# Altium project FMC_SDR_XFE.PrjPcb (part 1 of 3)
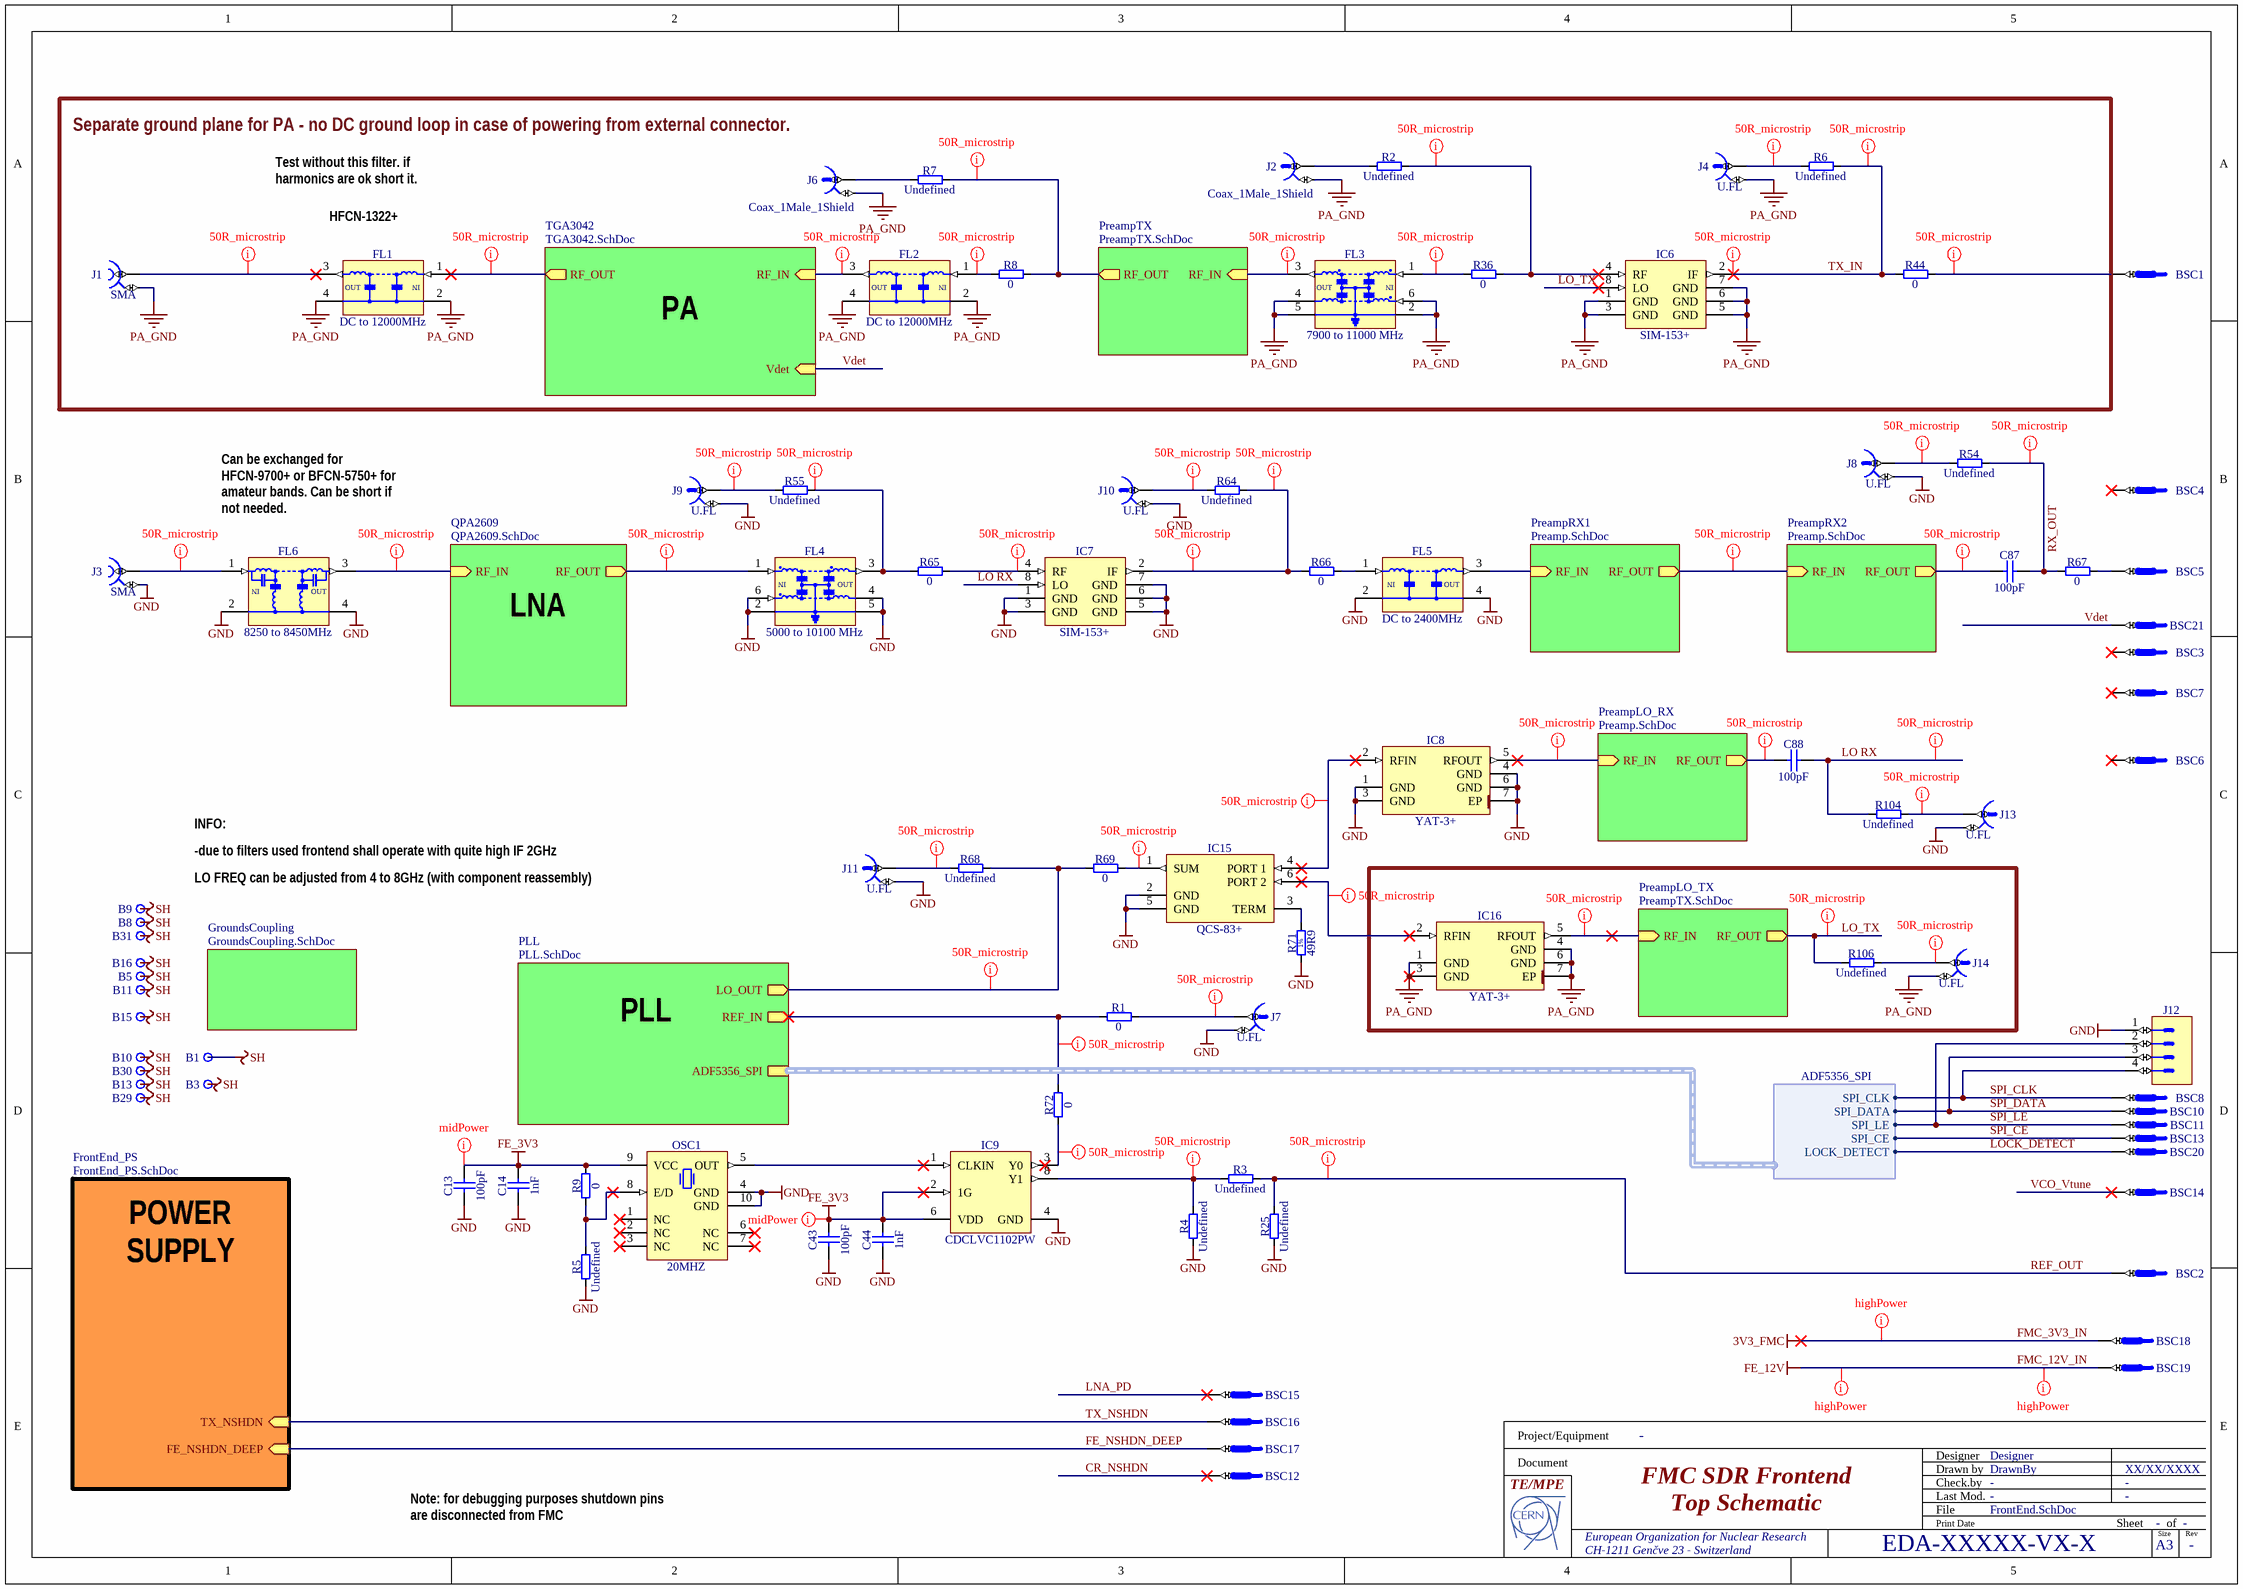
[diagram p0: FrontEnd.SchDoc]
14 sheets, 430 parts. Net scope: hierarchical (ports join the sheet entries above them; power ports are global).
Board file: FMC_SDR_XFE.PcbDoc
Sheets:
  FrontEnd.SchDoc
    FrontEnd_PS = FrontEnd_PS.SchDoc
      BUCKBOOST_PA = LTM8056.SchDoc
      INV_neg5V_PA = LTM8074neg_PA.SchDoc
      INV_neg5V = LTM8074neg.SchDoc
      BUCK_5V5_PA = LTM8074_PA.SchDoc
      BUCK_5V5 = LTM8074.SchDoc
      BUCK_3V8 = LTM8074.SchDoc
      PA_LDO = LT3080.SchDoc
    QPA2609 = QPA2609.SchDoc
    TGA3042 = TGA3042.SchDoc
    PLL = PLL.SchDoc
    PreampLO_RX = Preamp.SchDoc
    PreampLO_TX = PreampTX.SchDoc
    PreampTX = PreampTX.SchDoc
    PreampRX1 = Preamp.SchDoc
    PreampRX2 = Preamp.SchDoc
    GroundsCoupling = GroundsCoupling.SchDoc

## Sheet FrontEnd.SchDoc: FMC SDR Frontend
size 420 x 297 mm; CheckedBy: -; CompanyName: CERN; DrawnBy: DrawnBy; Organization: CERN; Address1: European Organization for Nuclear Research; Address2: CH-1211 Genčve 23 - Switzerland; Revision: -; SheetNumber: -; SheetTotal: -; EDA_Number: EDA-XXXXX-VX-X; Projet: -; ModifiedBy: -; CreateDate: XX/XX/XXXX; CheckedDate: -; Title2: Top Schematic; DivGrp: TE/MPE; Designer: Designer; ModifiedDate: -

### Parts
B1  Plated Hole  [MTG240_400]  (value not drawn)  (no BOM)
B3  Plated Hole  [MTG240_400]  (value not drawn)  (no BOM)
B5  Plated Hole  [MTG240_400]  (value not drawn)  (no BOM)
B8  Plated Hole  [MTG240_400]  (value not drawn)  (no BOM)
B9  Plated Hole  [MTG240_400]  (value not drawn)  (no BOM)
B10  Plated Hole  [MTG240_400]  (value not drawn)  (no BOM)
B11  Plated Hole  [MTG240_400]  (value not drawn)  (no BOM)
B13  Plated Hole  [MTG240_400]  (value not drawn)  (no BOM)
B15  Plated Hole  [MTG240_400]  (value not drawn)  (no BOM)
B16  Plated Hole  [MTG240_400]  (value not drawn)  (no BOM)
B29  Plated Hole  [MTG240_400]  (value not drawn)  (no BOM)
B30  Plated Hole  [MTG240_400]  (value not drawn)  (no BOM)
B31  Plated Hole  [MTG240_400]  (value not drawn)  (no BOM)
BSC1  06031206 Male  [PCB_CONN_0603M]  (value not drawn)
BSC2  06031206 Male  [PCB_CONN_0603M]  (value not drawn)
BSC3  06031206 Male  [PCB_CONN_0603M]  (value not drawn)
BSC4  06031206 Male  [PCB_CONN_0603M]  (value not drawn)
BSC5  06031206 Male  [PCB_CONN_0603M]  (value not drawn)
BSC6  06031206 Male  [PCB_CONN_0603M]  (value not drawn)
BSC7  06031206 Male  [PCB_CONN_0603M]  (value not drawn)
BSC8  06031206 Male  [PCB_CONN_0603M]  (value not drawn)
BSC10  06031206 Male  [PCB_CONN_0603M]  (value not drawn)
BSC11  06031206 Male  [PCB_CONN_0603M]  (value not drawn)
BSC12  06031206 Male  [PCB_CONN_0603M]  (value not drawn)
BSC13  06031206 Male  [PCB_CONN_0603M]  (value not drawn)
BSC14  06031206 Male  [PCB_CONN_0603M]  (value not drawn)
BSC15  06031206 Male  [PCB_CONN_0603M]  (value not drawn)
BSC16  06031206 Male  [PCB_CONN_0603M]  (value not drawn)
BSC17  06031206 Male  [PCB_CONN_0603M]  (value not drawn)
BSC18  1206 Male  [PCB_CONN_1206M]  (value not drawn)
BSC19  1206 Male  [PCB_CONN_1206M]  (value not drawn)
BSC20  06031206 Male  [PCB_CONN_0603M]  (value not drawn)
BSC21  06031206 Male  [PCB_CONN_0603M]  (value not drawn)
C13  100pF  [CAPC1005X55N]
C14  1nF  [CAPC1005X55N]
C43  100pF  [CAPC1005X55N]
C44  1nF  [CAPC1005X55N]
C87  100pF  [CAPC1005X55N]
C88  100pF  [CAPC1005X55N]
FL1  DC to 12000MHz  [FIL_MINI-CIRCUITS_FV1206-4]
FL2  DC to 12000MHz  [FIL_MINI-CIRCUITS_FV1206-4]
FL3  7900 to 11000 MHz  [FIL_MINI-CIRCUITS_FV1206-1]
FL4  5000 to 10100 MHz  [FIL_MINI-CIRCUITS_FV1206-1]
FL5  DC to 2400MHz  [FIL_MINI-CIRCUITS_FV1206]
FL6  8250 to 8450MHz  [FIL_MINI-CIRCUITS_FV1206-4]
IC6  SIM-153+  [MINI-CIRCUITS_HV1195]
IC7  SIM-153+  [MINI-CIRCUITS_HV1195]
IC8  YAT-3+  [MINI-CIRCUITS_MC1630]
IC9  CDCLVC1102PW  [SOP65P640X120-8N]
IC15  QCS-83+  [MINI-CIRCUITS_GE0805C-1]
IC16  YAT-3+  [MINI-CIRCUITS_MC1630]
J1  SMA  [TELEGARTNER_J01151A0451]
J2  Coax_1Male_1Shield  [ROSENBERGER_19S103-400L5]
J3  SMA  [TELEGARTNER_J01151A0451]
J4  U.FL  [HIROSE_U.FL-R-SMT-1(10)]
J6  Coax_1Male_1Shield  [ROSENBERGER_19S103-400L5]
J7  U.FL  [HIROSE_U.FL-R-SMT-1(10)]
J8  U.FL  [HIROSE_U.FL-R-SMT-1(10)]
J9  U.FL  [HIROSE_U.FL-R-SMT-1(10)]
J10  U.FL  [HIROSE_U.FL-R-SMT-1(10)]
J11  U.FL  [HIROSE_U.FL-R-SMT-1(10)]
J12  Header 4  [SAMTEC_HW-04-15-L-S-400-150]  (value not drawn)
J13  U.FL  [HIROSE_U.FL-R-SMT-1(10)]
J14  U.FL  [HIROSE_U.FL-R-SMT-1(10)]
OSC1  20MHZ  [OSC_KYOCERA_KT7050A]
R1  0  [RESC1005X40N]
R2  Undefined  [RESC1005X40N]
R3  Undefined  [RESC1005X40N]
R4  Undefined  [RESC1005X40N]
R5  Undefined  [RESC1005X40N]
R6  Undefined  [RESC1005X40N]
R7  Undefined  [RESC1005X40N]
R8  0  [RESC1005X40N]
R9  0  [RESC1005X40N]
R25  Undefined  [RESC1005X40N]
R36  0  [RESC1005X40N]
R44  0  [RESC1005X40N]
R54  Undefined  [RESC1005X40N]
R55  Undefined  [RESC1005X40N]
R64  Undefined  [RESC1005X40N]
R65  0  [RESC1005X40N]
R66  0  [RESC1005X40N]
R67  0  [RESC1005X40N]
R68  Undefined  [RESC1005X40N]
R69  0  [RESC1005X40N]
R71  49R9  [RESC1005X40N]
R72  0  [RESC1005X40N]
R104  Undefined  [RESC1005X40N]
R106  Undefined  [RESC1005X40N]

### Sub-sheets
FrontEnd_PS = FrontEnd_PS.SchDoc: TX_NSHDN (in), FE_NSHDN_DEEP (in)
GroundsCoupling = GroundsCoupling.SchDoc: no entries
PLL = PLL.SchDoc: REF_IN (out), ADF5356_SPI (harness ADF5356_SPI), LO_OUT (out)
PreampLO_RX = Preamp.SchDoc: RF_OUT (out), RF_IN (in)
PreampLO_TX = PreampTX.SchDoc: RF_OUT (out), RF_IN (in)
PreampRX1 = Preamp.SchDoc: RF_OUT (out), RF_IN (in)
PreampRX2 = Preamp.SchDoc: RF_OUT (out), RF_IN (in)
PreampTX = PreampTX.SchDoc: RF_OUT (out), RF_IN (in)
QPA2609 = QPA2609.SchDoc: RF_OUT (out), RF_IN (in)
TGA3042 = TGA3042.SchDoc: RF_OUT (out), RF_IN (in), Vdet (in)

### Harnesses
ADF5356_SPI: SPI_CLK, SPI_DATA, SPI_LE, LOCK_DETECT, SPI_CE

### Nets
FE_3V3: C13.2 C14.2 C43.2 C44.2 IC9.2(1G) IC9.6(VDD) OSC1.9(VCC) R9.2
FMC_3V3_IN: BSC18.1  [also labelled 3V3_FMC]
FMC_12V_IN: BSC19.1  [also labelled FE_12V]
GND: C13.1 C14.1 C43.1 C44.1 FL4.2(GND) FL4.4(GND) FL4.5(GND) FL4.6(RFIN) FL5.2(GND) FL5.4(GND) FL6.2(GND) FL6.4(GND) IC7.1(GND) IC7.3(GND) IC7.5(GND) IC7.6(GND) IC7.7(GND) IC8.1(GND) IC8.3(GND) IC8.4(GND) IC8.6(GND) IC8.7(EP) IC9.4(GND) IC15.2(GND) IC15.5(GND) J3.2 J7.2 J8.2 J9.2 J10.2 J11.2 J12.1 J13.2 OSC1.4(GND) OSC1.10(GND) R4.1 R5.1 R25.1 R71.1
PA_GND: FL1.2(GND) FL1.4(GND) FL2.2(GND) FL2.4(GND) FL3.2(GND) FL3.4(GND) FL3.5(GND) FL3.6(RFIN) IC6.1(GND) IC6.3(GND) IC6.5(GND) IC6.6(GND) IC6.7(GND) IC16.1(GND) IC16.3(GND) IC16.4(GND) IC16.6(GND) IC16.7(EP) J1.2 J2.2 J4.2 J6.2 J14.2
SH: B1.1 B3.1 B5.1 B8.1 B9.1 B10.1 B11.1 B13.1 B15.1 B16.1 B29.1 B30.1 B31.1
CR_NSHDN: BSC12.1
FE_NSHDN_DEEP: BSC17.1 ; sheet FrontEnd_PS/FE_NSHDN_DEEP  [project net FE_NSHDN]
LNA_PD: BSC15.1
LO RX: C88.2 IC7.8(LO) R104.2
LO_TX: IC6.8(LO) R106.2 ; sheet PreampLO_TX/RF_OUT
LOCK_DETECT: BSC20.1 ; sheet PLL/ADF5356_SPI.LOCK_DETECT
REF_OUT: BSC2.1 R3.2 R25.2
RX_OUT: C87.2 R54.2 R67.1
SPI_CE: BSC13.1 ; sheet PLL/ADF5356_SPI.SPI_CE  [project net 5356_SPI_CE]
SPI_CLK: BSC8.1 J12.4 ; sheet PLL/ADF5356_SPI.SPI_CLK  [project net 5356_SPI_CLK]
SPI_DATA: BSC10.1 J12.3 ; sheet PLL/ADF5356_SPI.SPI_DATA  [project net 5356_SPI_DATA]
SPI_LE: BSC11.1 J12.2 ; sheet PLL/ADF5356_SPI.SPI_LE  [project net 5356_SPI_LE]
TX_IN: IC6.2(IF) R6.2 R44.1
TX_NSHDN: BSC16.1 ; sheet FrontEnd_PS/TX_NSHDN
VCO_Vtune: BSC14.1
Vdet: BSC21.1 ; sheet TGA3042/Vdet
NetBSC1_1: BSC1.1 R44.2
NetBSC5_1: BSC5.1 R67.2
NetC10_PreampLO_RX_1: IC8.5(RFOUT) ; sheet PreampLO_RX/RF_IN
NetC10_PreampRX1_1: FL5.3(RFOUT) ; sheet PreampRX1/RF_IN
NetC10_PreampRX2_1: sheet PreampRX1/RF_OUT, sheet PreampRX2/RF_IN
NetC37_2: R68.2 R69.1 ; sheet PLL/LO_OUT
NetC47_1: R1.2 R72.2 ; sheet PLL/REF_IN
NetC81_PreampTX_2: R7.2 R8.2 ; sheet PreampTX/RF_OUT
NetC82_PreampLO_TX_1: IC16.5(RFOUT) ; sheet PreampLO_TX/RF_IN
NetC82_PreampTX_1: FL3.3(RFOUT) ; sheet PreampTX/RF_IN
NetC87_1: C87.1 ; sheet PreampRX2/RF_OUT
NetC88_1: C88.1 ; sheet PreampLO_RX/RF_OUT
NetFL1_1: FL1.1(RFIN) ; sheet TGA3042/RF_OUT
NetFL1_3: FL1.3(RFOUT) J1.1
NetFL2_1: FL2.1(RFIN) R8.1
NetFL2_3: FL2.3(RFOUT) ; sheet TGA3042/RF_IN
NetFL3_1: FL3.1(RFIN) R36.1
NetFL4_1: FL4.1(RFIN) ; sheet QPA2609/RF_OUT
NetFL4_3: FL4.3(RFOUT) R55.2 R65.1
NetFL5_1: FL5.1(RFIN) R66.2
NetFL6_1: FL6.1(RFIN) J3.1
NetFL6_3: FL6.3(RFOUT) ; sheet QPA2609/RF_IN
NetIC6_4: IC6.4(RF) R2.2 R36.2
NetIC7_2: IC7.2(IF) R64.2 R66.1
NetIC7_4: IC7.4(RF) R65.2
NetIC8_2: IC8.2(RFIN) IC15.4(PORT_1)
NetIC9_1: IC9.1(CLKIN) OSC1.5(OUT)
NetIC9_3: IC9.3(Y0) R72.1
NetIC9_8: IC9.8(Y1) R3.1 R4.2
NetIC15_1: IC15.1(SUM) R69.2
NetIC15_3: IC15.3(TERM) R71.2
NetIC15_6: IC15.6(PORT_2) IC16.2(RFIN)
NetJ2_1: J2.1 R2.1
NetJ4_1: J4.1 R6.1
NetJ6_1: J6.1 R7.1
NetJ7_1: J7.1 R1.1
NetJ8_1: J8.1 R54.1
NetJ9_1: J9.1 R55.1
NetJ10_1: J10.1 R64.1
NetJ11_1: J11.1 R68.1
NetJ13_1: J13.1 R104.1
NetJ14_1: J14.1 R106.1
NetOSC1_8: OSC1.8(E/D) R5.2 R9.1

Not connected (* = marked no-connect by the designer): BSC3 1*; BSC4 1*; BSC6 1*; BSC7 1*; OSC1 1(NC)* 2(NC)* 3(NC)* 6(NC)* 7(NC)*

### Layout directives
net class 50R_class: LO RX, LO_TX, NetBSC1_1, NetC10_PreampLO_RX_1, NetC10_PreampRX2_1, NetC37_2, NetC47_1, NetC81_PreampTX_2, NetC82_PreampLO_TX_1, NetC82_PreampTX_1, NetC87_1, NetC88_1, NetFL1_1, NetFL1_3, NetFL2_1, NetFL2_3, NetFL3_1, NetFL4_1, NetFL4_3, NetFL6_1, NetFL6_3, NetIC6_4, NetIC7_2, NetIC7_4, NetIC8_2, NetIC9_3, NetIC9_8, NetIC15_1, NetIC15_6, NetJ4_1, NetJ7_1, NetJ8_1, NetJ9_1, NetJ10_1, NetJ11_1, NetJ13_1, NetJ14_1, REF_OUT, RX_OUT, TX_IN
net class highPower: FMC_3V3_IN, FMC_12V_IN
net class midPower: FE_3V3

### Notes on the sheet
- Separate ground plane for PA - no DC ground loop in case of powering from external connector.
- Test without this filter. if harmonics are ok short it.
- (near FL1) HFCN-1322+
- PA
- Can be exchanged for HFCN-9700+ or BFCN-5750+ for amateur bands. Can be short if not needed.
- LNA
- -due to filters used frontend shall operate with quite high IF 2GHz
- INFO:
- LO FREQ can be adjusted from 4 to 8GHz (with component reassembly)
- PLL
- POWER
  SUPPLY
- Note: for debugging purposes shutdown pins are disconnected from FMC
- Project/Equipment
- Document
- Designer
- Drawn by
- Check.by
- File
- Last Mod.
- Print Date
- Sheet
- Size
- A3
- of
- Rev
- (in symbol FIL_MINI-CIRCUITS_BFCN-8350+) IN; OUT
- (in symbol FIL_MINI-CIRCUITS_HFCN-4400+) IN; OUT
- (in symbol FIL_MINI-CIRCUITS_HFCN-7150+) OUT; IN
- (in symbol FIL_MINI-CIRCUITS_LFCN-123+) OUT; IN
- (in symbol FIL_MINI-CIRCUITS_LFCN-2400+) IN; OUT
- (in symbol R0402_49R9_1%_0.0625W_100PPM) 1%

### Library data of the parts
B1 B3 B5 B8-B11 B13 B15 B16 B29-B31 = PLATED_HOLE2.4_PAD4.0: Single Terminal Socket; Part Description: Plated Through Hole: Hole Dia.=2.4mm Pad Dia.=4.0mm; Mounted: No; Table: Pads; Part Number: PLATED_HOLE2.4_PAD4.0; Component Type: Standard (No BOM); Pin Count: 1; Family: Plated Hole; Socket: No; SMD: No; Status: None; ComponentHeight: 0mm; Author: CERN DEM JMW; CreateDate: 2011-10-10; LatestRevisionDate: 2011-10-10; PackageDescription: Plated Through Hole: Hole Dia.=2.4mm Pad Dia.=4.0mm
BSC1-BSC8 BSC10-BSC17 BSC20 BSC21 = 0603_male_BoardSolderConnector: Part Description: Board connection - soldered 0603 jumper; PressFit: No; Pin Count: 1; Socket: No; SMD: Yes; Sense: No; Status: None; System: Connector
BSC18 BSC19 = 1206_male_BoardSolderConnector: Part Description: Board connection - soldered 1206 jumper; PressFit: No; Pin Count: 1; Socket: No; SMD: Yes; Sense: No; Status: None; System: Connector
C13 C43 C87 C88 = CC0402_100PF_50V_5%_C0G: Non-polarised capacitor; Part Description: SMD Multilayer Chip Ceramic Capacitor; Manufacturer: GENERIC; Manufacturer1 Part Number: C0402C101J5GACTU; Voltage: 50V; TC: C0G/NP0; Tolerance: ±5%; Part Number: CC0402_100PF_50V_5%_C0G; Component Kind: Standard; Component Type: Standard; Pin Count: 2; Value: 100pF; Status: Preferred; Manufacturer Part Number: CC0402_100PF_50V_5%_C0G; Case: 0402; Mounted: Yes; Socket: No; SMD: Yes; Sense: No; Manufacturer1 Example: KEMET; Manufacturer1 ComponentHeight: 0.55mm; HelpURL: \\cern.ch\dfs\Applications\Altium\Datasheets\CC0805_C0G_KEMET_(Commercial Grade).pdf; Author: CERN DEM JLC; CreateDate: 03.12.2007; LatestRevisionDate: 22.04.2015
C14 C44 = CC0402_1NF_50V_10%_X7R: Non-polarised capacitor; Part Description: SMD Multilayer Chip Ceramic Capacitor; Manufacturer: GENERIC; Manufacturer1 Part Number: 223858715623; Voltage: 50V; TC: X7R; Tolerance: ±10%; Part Number: CC0402_1NF_50V_10%_X7R; Component Kind: Standard; Component Type: Standard; Pin Count: 2; Value: 1nF; Status: Not Recommended; Manufacturer Part Number: CC0402_1NF_50V_10%_X7R; Case: 0402; Mounted: Yes; Socket: No; SMD: Yes; Sense: No; Manufacturer1 Example: PHYCOMP; Manufacturer1 ComponentHeight: 0.55mm; HelpURL: \\cern.ch\dfs\Applications\Altium\Datasheets\CC0402_X7R_PHYCOMP.pdf; Author: CERN DEM JLC; CreateDate: 03.12.2007; LatestRevisionDate: 03.12.2007
FL1 FL2 = FIL_MINI-CIRCUITS_LFCN-123+: 50 Ohm DC to 12000MHz Low Pass Filter; Part Description: 50 Ohm Low Pass Filter; Part Number: FIL_MINI-CIRCUITS_LFCN-123+; Component Kind: Standard; Component Type: Standard; Pin Count: 2; Value: DC to 12000MHz; Status: None; Manufacturer: MINI-CIRCUITS; Manufacturer Part Number: LFCN-123+; Mounted: Yes; Socket: No; SMD: Yes; Sense: No; ComponentHeight: 1.04mm; HelpURL: \\cern.ch\dfs\Applications\Altium\Datasheets\FIL_MINI-CIRCUITS_LFCN-123+.pdf; Author: CERN DEM JLC; CreateDate: 20.04.2015; LatestRevisionDate: 20.04.2015
FL3 = FIL_MINI-CIRCUITS_HFCN-7150+: 50 Ohm 7900 to 11000 MHz  Bandpass Filter; Part Description: 50 Ohm Dual Low Pass Filter; Part Number: FIL_MINI-CIRCUITS_HFCN-7150+; Component Kind: Standard; Component Type: Standard; Pin Count: 2; Value: 7900 to 11000 MHz; Status: None; Manufacturer: MINI-CIRCUITS; Manufacturer Part Number: HFCN-7150+; Mounted: Yes; Socket: No; SMD: Yes; Sense: No; ComponentHeight: 0.89mm; HelpURL: \\cern.ch\dfs\Applications\Altium\Datasheets\FIL_MINI-CIRCUITS_LFCN-291-1PM+.pdf; Author: SH based on CERN; CreateDate: 27.10.2019; LatestRevisionDate: 29.03.2018
FL4 = FIL_MINI-CIRCUITS_HFCN-4400+: 50 Ohm 5000 to 10100 MHz   Bandpass Filter; Part Description: 50 Ohm Dual Band Pass Filter; Part Number: FIL_MINI-CIRCUITS_HFCN-4400+; Component Kind: Standard; Component Type: Standard; Pin Count: 2; Value: 5000 to 10100 MHz; Status: None; Manufacturer: MINI-CIRCUITS; Manufacturer Part Number: HFCN-4400+; Mounted: Yes; Socket: No; SMD: Yes; Sense: No; ComponentHeight: 0.89mm; HelpURL: \\cern.ch\dfs\Applications\Altium\Datasheets\FIL_MINI-CIRCUITS_LFCN-291-1PM+.pdf; Author: SH based on CERN; CreateDate: 27.10.2019; LatestRevisionDate: 27.10.2017
FL5 = FIL_MINI-CIRCUITS_LFCN-2400+: 50 Ohm DC to 2400MHz Low Pass Filter; Part Description: 50 Ohm Low Pass Filter; Part Number: FIL_MINI-CIRCUITS_LFCN-2400+; Component Kind: Standard; Component Type: Standard; Pin Count: 4; Value: DC to 2400MHz; Status: None; Manufacturer: MINI-CIRCUITS; Manufacturer Part Number: LFCN-2400+; Mounted: Yes; Socket: No; SMD: Yes; Sense: No; ComponentHeight: 0.94mm; HelpURL: \\cern.ch\dfs\Applications\Altium\Datasheets\FIL_MINI-CIRCUITS_LFCN-2400+.pdf; Author: CERN DEM MR; CreateDate: 05.04.2019; LatestRevisionDate: 05.04.2019
FL6 = FIL_MINI-CIRCUITS_BFCN-8350+: 50 Ohm 8250 to 8450MHz Band Pass Filter; Part Description: 50 Ohm Band Pass Filter; Part Number: FIL_MINI-CIRCUITS_BFCN-8350+; Component Kind: Standard; Component Type: Standard; Pin Count: 4; Value: 8250 to 8450MHz; Status: None; Manufacturer: MINI-CIRCUITS; Manufacturer Part Number: BFCN-8350+; Mounted: Yes; Socket: No; SMD: Yes; Sense: No; ComponentHeight: 1.04mm; HelpURL: \\cern.ch\dfs\Applications\Altium\Datasheets\FIL_MINI-CIRCUITS_BFCN-8350+.pdf; Author: CERN DEM MR; CreateDate: 05.04.2019; LatestRevisionDate: 05.04.2019
IC6 IC7 = SIM-153+: Level 7 (LO Power +7 dBm) 3400 to 15000 MHz; Part Description: Frequency Mixer - Level 13 (LO Power +13 dBm) 7300 to 20000MHz; Manufacturer: MINI-CIRCUITS; PressFit: No; Bonding: No; Part Number: SIM-153+; Component Kind: Standard; Component Type: Standard; Device: SIM-153+; PackageDescription: MINI-CIRCUITS HV1195 Case, 1.27mm pitch; 8 pin, 4.57mm W X 5.08mm L; Manufacturer Part Number: SIM-153+; Pin Count: 8; Mounted: Yes; Socket: No; SMD: Yes; Sense: No; ComponentHeight: 2.21mm; Author: CERN DEM JLC; HelpURL: \\cern.ch\dfs\Applications\Altium\Datasheets\SIM-24MH+.pdf; CreateDate: 29.10.2014; LatestRevisionDate: 29.10.2014
IC8 IC16 = YAT-3+: DC to 18GHz, 2W, 50 Ohm, 4dB Attenuator; Part Description: DC to 18GHz,  2W, 50 Ohms, 3dB Attenuator; Manufacturer: MINI-CIRCUITS; PressFit: No; Bonding: No; Part Number: YAT-3+; Component Kind: Standard; Component Type: Standard; Device: YAT-3+; PackageDescription: MINI-CIRCUITS MC1630 Case, 0.65mm pitch, 6 pin, 2mm X 2mm X 0.85mm H body (w/thermal tab 0.65 X 1.25mm); Manufacturer Part Number: YAT-3+; Pin Count: 7; Mounted: Yes; Socket: No; SMD: Yes; Sense: No; ComponentHeight: 0.85mm; Author: CERN DEM JLC; HelpURL: \\cern.ch\dfs\Applications\Altium\Datasheets\YAT-3+.pdf; CreateDate: 20.04.2015; LatestRevisionDate: 20.04.2015
IC9 = CDCLVC1102PW: 3.3 V and 2.5 V LVCMOS 1:2  High-Performance Clock Buffer; Manufacturer: TEXAS INSTRUMENTS; PressFit: No; Bonding: No; Part Number: CDCLVC1102PW; Component Kind: Standard; Component Type: Standard; Device: CDCLVC1102PW; PackageDescription: SOP, 0.65mm pitch; 8 pin, 4.40mm W X 3.00mm L X 1.20mm H body, IPC Medium Density; Part Description: 3.3 V and 2.5 V LVCMOS 1:2 High-Performance Clock Buffer; Manufacturer Part Number: CDCLVC1102PW; Pin Count: 8; Case: TSSOP8; Mounted: Yes; Socket: No; SMD: Yes; Sense: No; ComponentHeight: 1.2mm; HelpURL: \\cern.ch\dfs\Applications\Altium\Datasheets\CDCLVC1102PW.pdf; Author: CERN DEM JLC; CreateDate: 28.02.2011; LatestRevisionDate: 28.02.2011
IC15 = QCS-83+: 2 Way-90° Power Splitter,50Ω 4000 to 8000 MHz; Part Description: 2 Way-0°, 50 Ohms, 1 to 650MHz, Power Splitter/Combiner; Manufacturer: MINI-CIRCUITS; PressFit: No; Bonding: No; Part Number: QCS-83+; Component Kind: Standard; Component Type: Standard; Device: QCS-83+; PackageDescription: MINI-CIRCUITS_GE0805C-1; Manufacturer Part Number: QCS-83+; Pin Count: 6; Mounted: Yes; Socket: No; SMD: Yes; Sense: No; ComponentHeight: 0.84mm; Author: SH based on CERN; HelpURL: \\cern.ch\dfs\Applications\Altium\Datasheets\ADP-2-1W+.pdf; CreateDate: 27.10.2019; LatestRevisionDate: 27.10.2019
J1 J3 = Coax_1Female_1Shield: Part Description: SMA 50 ohms Edge Mount Bulkhead Jack Receptacle; Manufacturer: TELEGARTNER; Manufacturer Part Number: J01151A0451; PressFit: No; Part Number: TELEGARTNER_J01151A0451; Component Kind: Standard; Component Type: Standard; Pin Count: 2; Family: SMA; Mounted: Yes; Socket: No; SMD: No; Sense: No; Status: None; ComponentHeight: 7mm; HelpURL: \\cern.ch\dfs\Applications\Altium\Datasheets\TELEGARTNER_J01151A0451.pdf; Author: CERN DEM JLC; CreateDate: 27/10/2016; LatestRevisionDate: 27/10/2016
J2 J6 = ROSENBERGER_19S103-400L5: Part Description: SMP Straight Plug PCB, 50 Ohms, DC to 26.5GHz; PressFit: No; Part Number: ROSENBERGER_19S103-400L5; Component Kind: Standard; Component Type: Standard; Pin Count: 5; Family: SMP; Mounted: Yes; Socket: No; SMD: Yes; Sense: No; Status: None; Manufacturer: ROSENBERGER; Manufacturer Part Number: 19S103-400L5; ComponentHeight: 4.1mm; HelpURL: \\cern.ch\dfs\Applications\Altium\Datasheets\ROSENBERGER_19S103-400L5.pdf; Author: CERN DEM JMW; CreateDate: 29.11.2017; LatestRevisionDate: 29.11.2017
J4 J7-J11 J13 J14 = HIROSE_U.FL-R-SMT-1(10): Part Description: Up to 6GHz Ultra Small Surface Mount Male Coaxial Connectors U.FL Series; Manufacturer: HIROSE (HRS); PressFit: No; Part Number: HIROSE_U.FL-R-SMT-1(10); Component Kind: Standard; Component Type: Standard; Pin Count: 2; Family: U.FL; Mounted: Yes; Socket: No; SMD: Yes; Sense: No; Status: None; Manufacturer Part Number: U.FL-R-SMT-1(10); ComponentHeight: 1.25mm; HelpURL: \\cern.ch\dfs\Applications\Altium\Datasheets\HIROSE_U.FL-R-SMT-1(10).pdf; Author: CERN DEM JLC; CreateDate: 24.03.2010; LatestRevisionDate: 24.03.2010
J12 = SAMTEC_HW-04-15-L-S-400-150: Connector 4 Male; Part Description: 4 Contacts, Pitch 2.54mm, Single Row Straight .Flex Stack, Flexible Board Stacker (Stacker Height = 10.16mm(400), Tail Length 3.81mm (150)); Manufacturer: SAMTEC; PressFit: No; Part Number: SAMTEC_HW-04-15-L-S-400-150; Component Kind: Standard; Component Type: Standard; Pin Count: 4; Family: Header 4; Mounted: Yes; Socket: No; Sense: No; SMD: No; Status: None; Manufacturer Part Number: HW-04-15-L-S-400-150; ComponentHeight: 16mm; HelpURL: \\cern.ch\dfs\Applications\Altium\Datasheets\SAMTEC_HW-04-15-L-S-400-150.pdf; Author: CERN DEM MR; CreateDate: 07.06.2018; LatestRevisionDate: 07.06.2018
OSC1 = OSC_20MHZ_KYOCERA_KT7050A20000KAW33TAD: Oscillator KYOCERA; Part Description: 3.3V, ± 0.28ppm, -40°C ..+85°C, Temperature Compensated Crystal Oscillator (TCXO); PressFit: No; Bonding: No; Part Number: OSC_20MHZ_KYOCERA_KT7050A20000KAW33TAD; Component Kind: Standard; Component Type: Standard; PackageDescription: Oscillator KT7050A Series, 10 pins, 5x7mm; Value: 20MHZ; Manufacturer: KYOCERA; Manufacturer Part Number: KT7050A20000KAW33TAD; Pin Count: 10; Mounted: Yes; Socket: No; SMD: Yes; Sense: No; ComponentHeight: 1.7mm; HelpURL: \\cern.ch\dfs\Applications\Altium\Datasheets\OSC_KYOCERA_KT7050.pdf; Author: CERN DEM MR; CreateDate: 01.12.2017; LatestRevisionDate: 01.12.2017
R1 R8 R9 R36 R44 R65-R67 R69 R72 = R0402_0R_JUMPER: Resistor; Part Description: 1A (0.05R Max DC Resistance) Zero Ohm Jumper; Manufacturer: GENERIC; Manufacturer1 Part Number: 232270591001L; PressFit: No; Part Number: R0402_0R_JUMPER; Component Kind: Standard; Component Type: Standard; Pin Count: 2; Value: 0; Status: Not Recommended; Manufacturer Part Number: R0402_0R_JUMPER; Case: 0402; Mounted: Yes; Sense: No; Socket: No; SMD: Yes; Manufacturer1 Example: YAGEO PHYCOMP; Manufacturer1 ComponentHeight: 0.4mm; HelpURL: \\cern.ch\dfs\Applications\Altium\Datasheets\R0402_Phycomp_RC0402.pdf; Author: CERN DEM JLC; CreateDate: 03.12.2007; LatestRevisionDate: 17.10.2012
R2-R7 R25 R54 R55 R64 R68 R104 R106 = R0402_NO-VALUE: Resistor; Part Description: Reserved Footprint For a 0402 (1005) Chip Resistor; PressFit: No; Mounted: No; Part Number: R0402_NO-VALUE; Component Kind: Standard; Component Type: Standard; Pin Count: 2; Value: Undefined; Status: None; Manufacturer: Undefined; Manufacturer Part Number: R0402_NO-VALUE; Case: 0402; Sense: No; Socket: No; SMD: Yes; Manufacturer1 Example: Undefined; Manufacturer1 Part Number: Undefined; Manufacturer1 ComponentHeight: Undefined; HelpURL: Undefined; Author: CERN DEM JLC; CreateDate: 03.12.2007; LatestRevisionDate: 13.03.2008
R71 = R0402_49R9_1%_0.0625W_100PPM: Resistor - 1%; Part Description: General Purpose Thick Film Chip Resistor; Manufacturer: GENERIC; Manufacturer1 Part Number: 232270674999L or RC0402FR-0749R9L; TC: ±100ppm/°C; PressFit: No; Part Number: R0402_49R9_1%_0.0625W_100PPM; Component Kind: Standard; Component Type: Standard; Pin Count: 2; Value: 49R9; Status: Not Recommended; Power: 0.0625W; Tolerance: ±1%; Manufacturer Part Number: R0402_49R9_1%_0.0625W_100PPM; Case: 0402; Mounted: Yes; Sense: No; Socket: No; SMD: Yes; Manufacturer1 Example: YAGEO PHYCOMP; Manufacturer1 ComponentHeight: 0.4mm; HelpURL: \\cern.ch\dfs\Applications\Altium\Datasheets\R0402_Phycomp_RC0402.pdf; Author: CERN DEM JLC; CreateDate: 24.10.2012; LatestRevisionDate: 24.10.2012

## Sheet FrontEnd_PS.SchDoc: FMC SDR Frontend
size 420 x 297 mm; CheckedBy: -; CompanyName: CERN; DrawnBy: DrawnBy; Organization: CERN; Address1: European Organization for Nuclear Research; Address2: CH-1211 Genčve 23 - Switzerland; Revision: -; SheetNumber: -; SheetTotal: -; EDA_Number: EDA-XXXXX-VX-X; Projet: -; ModifiedBy: -; CreateDate: XX/XX/XXXX; CheckedDate: -; Title2: Power Supply Top sheet; DivGrp: TE/MPE; Designer: Designer; ModifiedDate: -
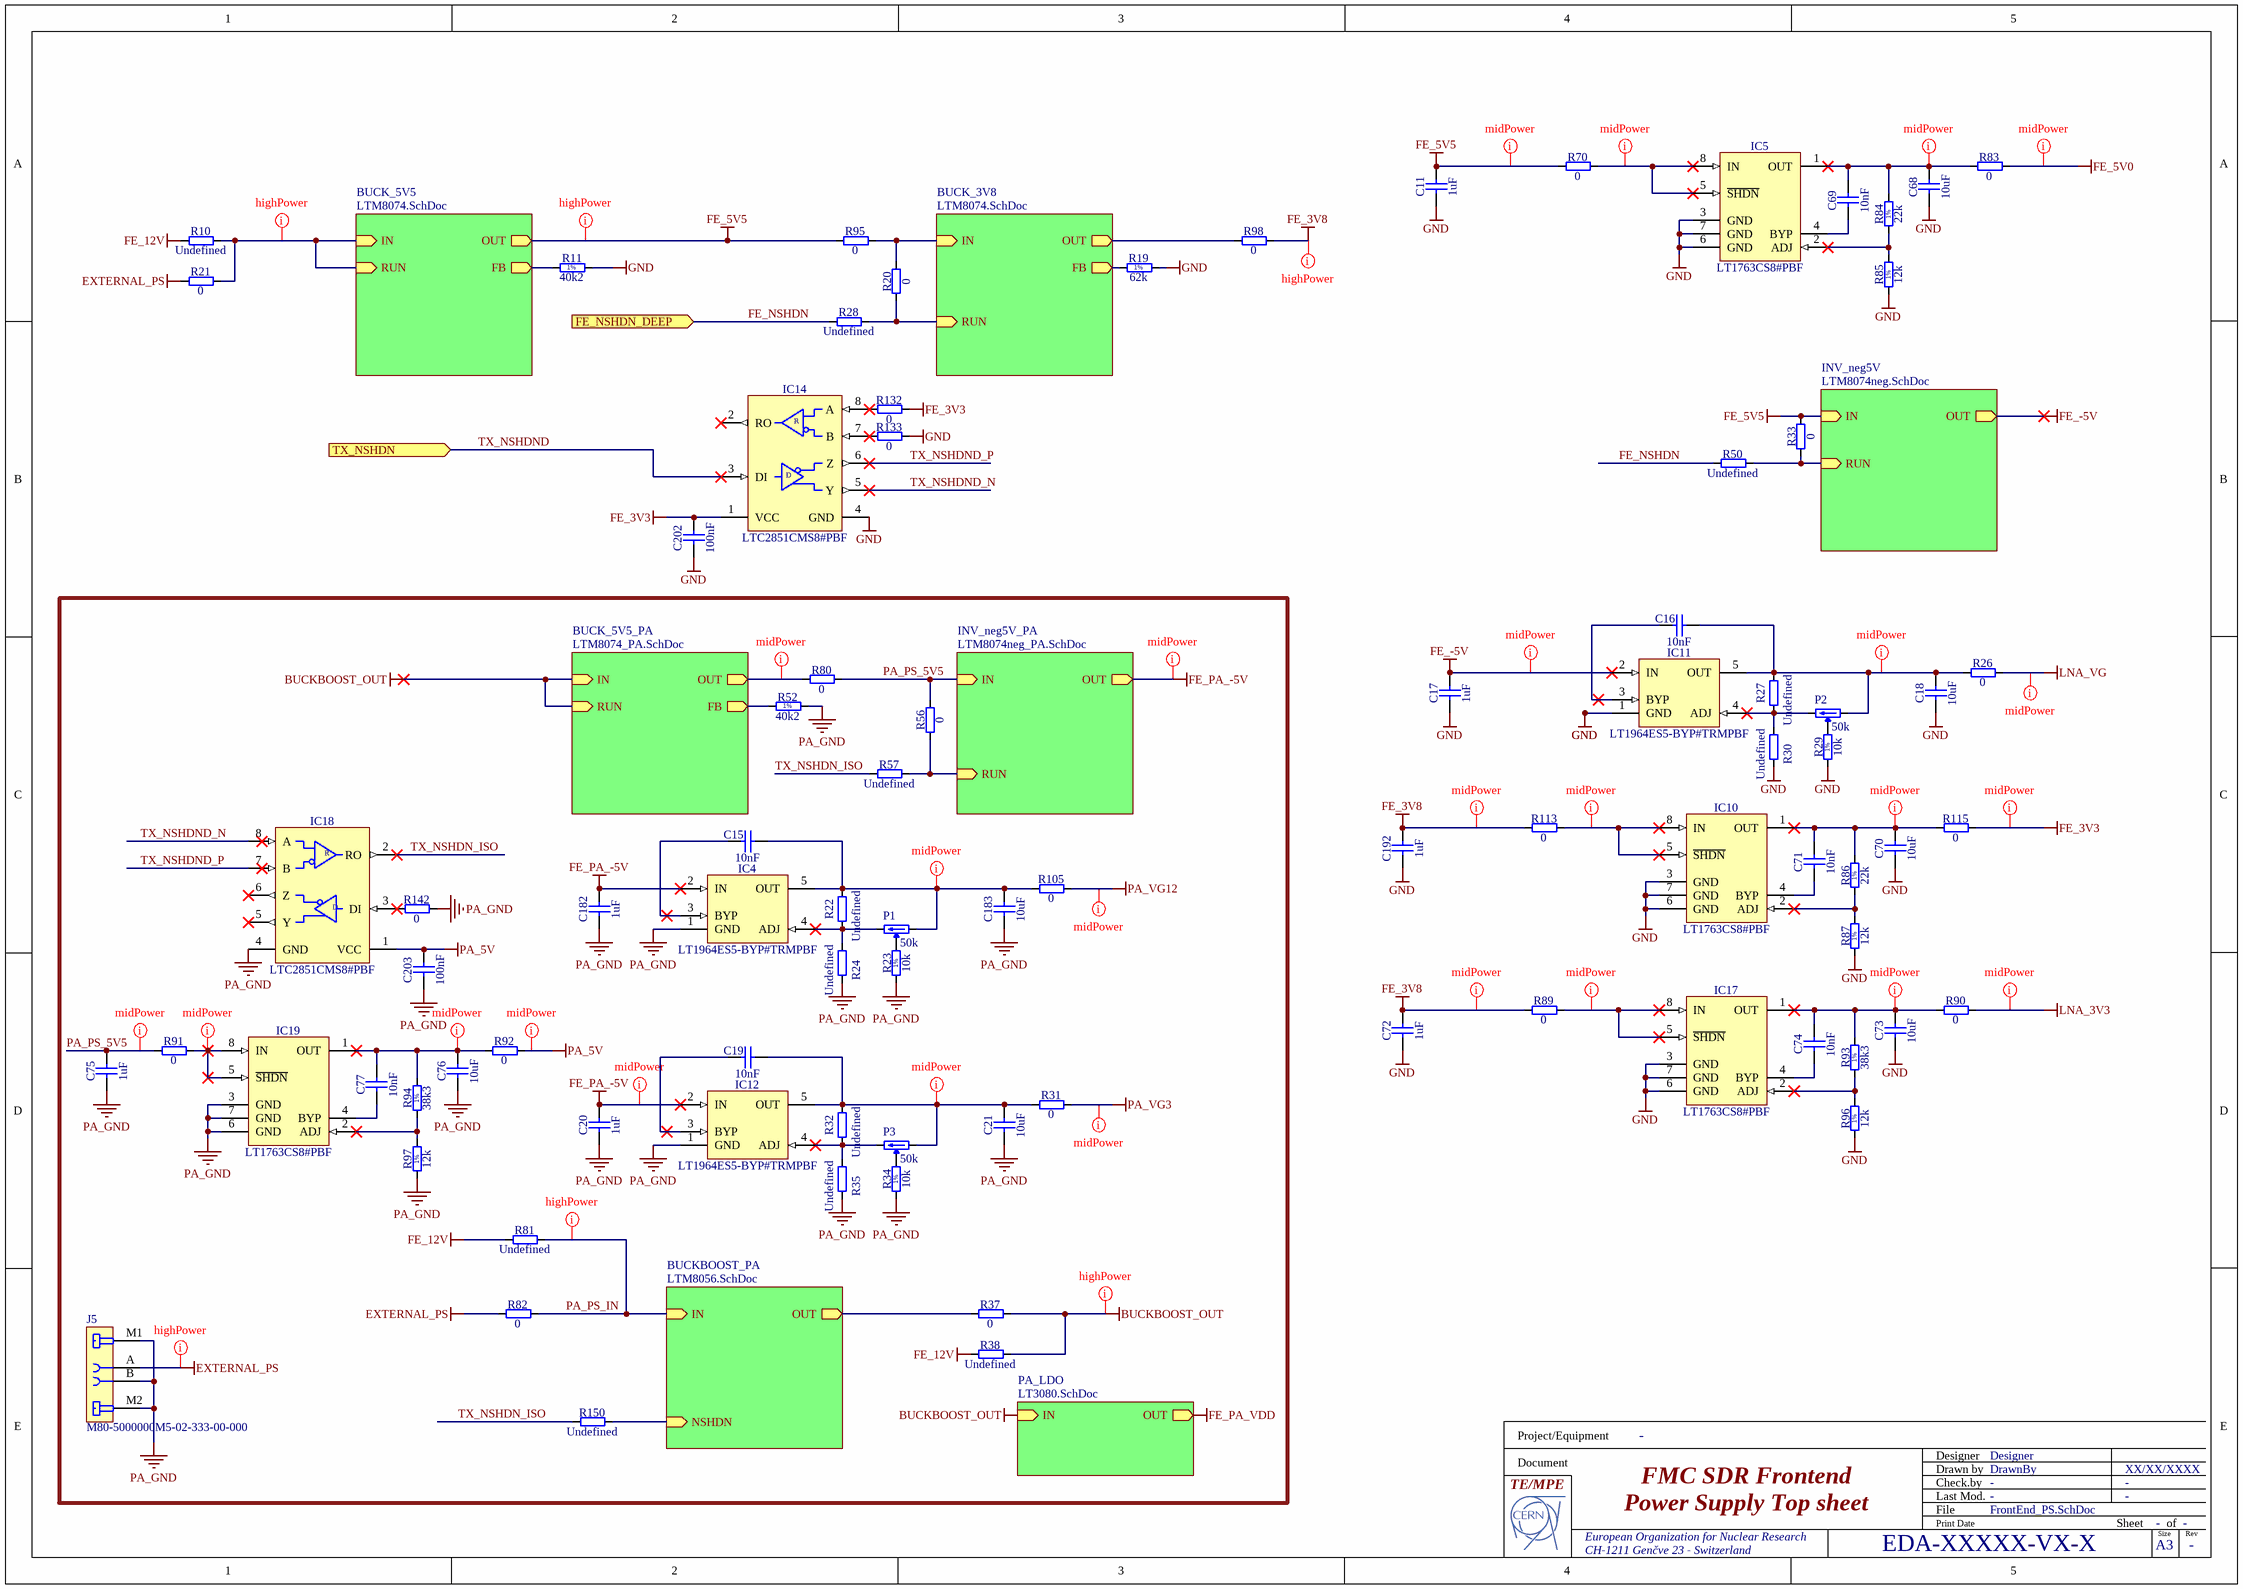
[diagram p1: FrontEnd_PS.SchDoc]

### Parts
C11  1uF  [CAPC1608X87N]
C15  10nF  [CAPC1608X87N]
C16  10nF  [CAPC1608X87N]
C17  1uF  [CAPC1608X87N]
C18  10uF  [CAPC2012X95N]
C19  10nF  [CAPC1608X87N]
C20  1uF  [CAPC1608X87N]
C21  10uF  [CAPC2012X95N]
C68  10uF  [CAPC2012X95N]
C69  10nF  [CAPC1005X55N]
C70  10uF  [CAPC2012X95N]
C71  10nF  [CAPC1005X55N]
C72  1uF  [CAPC1608X87N]
C73  10uF  [CAPC2012X95N]
C74  10nF  [CAPC1005X55N]
C75  1uF  [CAPC1608X87N]
C76  10uF  [CAPC2012X95N]
C77  10nF  [CAPC1005X55N]
C182  1uF  [CAPC1608X87N]
C183  10uF  [CAPC2012X95N]
C192  1uF  [CAPC1608X87N]
C202  100nF  [CAPC1005X55N]
C203  100nF  [CAPC1005X55N]
IC4  LT1964ES5-BYP#TRMPBF  [SOT95P280X100-5N]
IC5  LT1763CS8#PBF  [SOIC127P600X175-8N]
IC10  LT1763CS8#PBF  [SOIC127P600X175-8N]
IC11  LT1964ES5-BYP#TRMPBF  [SOT95P280X100-5N]
IC12  LT1964ES5-BYP#TRMPBF  [SOT95P280X100-5N]
IC14  LTC2851CMS8#PBF  [SOP65P490X110-8N]
IC17  LT1763CS8#PBF  [SOIC127P600X175-8N]
IC18  LTC2851CMS8#PBF  [SOP65P490X110-8N]
IC19  LT1763CS8#PBF  [SOIC127P600X175-8N]
J5  M80-5000000M5-02-333-00-000  [M80-5000000M5-02-333-00-000]
P1  50k  [TRIM_BOURNS_3223W]
P2  50k  [TRIM_BOURNS_3223W]
P3  50k  [TRIM_BOURNS_3223W]
R10  Undefined  [RESC3216X65N]
R11  40k2  [RESC2012X60N]
R19  62k  [RESC2012X60N]
R20  0  [RESC1608X55N]
R21  0  [RESC3216X65N]
R22  Undefined  [RESC1608X55N]
R23  10k  [RESC1005X40N]
R24  Undefined  [RESC1608X55N]
R26  0  [RESC1608X55N]
R27  Undefined  [RESC1608X55N]
R28  Undefined  [RESC1608X55N]
R29  10k  [RESC1005X40N]
R30  Undefined  [RESC1608X55N]
R31  0  [RESC1608X55N]
R32  Undefined  [RESC1608X55N]
R33  0  [RESC1608X55N]
R34  10k  [RESC1005X40N]
R35  Undefined  [RESC1608X55N]
R37  0  [RESC3216X65N]
R38  Undefined  [RESC3216X65N]
R50  Undefined  [RESC1608X55N]
R52  40k2  [RESC2012X60N]
R56  0  [RESC1608X55N]
R57  Undefined  [RESC1608X55N]
R70  0  [RESC1608X55N]
R80  0  [RESC3216X65N]
R81  Undefined  [RESC3216X65N]
R82  0  [RESC3216X65N]
R83  0  [RESC1608X55N]
R84  22k  [RESC1005X40N]
R85  12k  [RESC1005X40N]
R86  22k  [RESC1005X40N]
R87  12k  [RESC1005X40N]
R89  0  [RESC1608X55N]
R90  0  [RESC1608X55N]
R91  0  [RESC1608X55N]
R92  0  [RESC1608X55N]
R93  38k3  [RESC1005X40N]
R94  38k3  [RESC1005X40N]
R95  0  [RESC3216X65N]
R96  12k  [RESC1005X40N]
R97  12k  [RESC1005X40N]
R98  0  [RESC3216X65N]
R105  0  [RESC1608X55N]
R113  0  [RESC1608X55N]
R115  0  [RESC1608X55N]
R132  0  [RESC1608X55N]
R133  0  [RESC1608X55N]
R142  0  [RESC1608X55N]
R150  Undefined  [RESC1608X55N]

### Sub-sheets
BUCK_3V8 = LTM8074.SchDoc: IN (in), OUT (out), FB (out), RUN (in)
BUCK_5V5 = LTM8074.SchDoc: IN (in), OUT (out), FB (out), RUN (in)
BUCK_5V5_PA = LTM8074_PA.SchDoc: IN (in), OUT (out), FB (out), RUN (in)
BUCKBOOST_PA = LTM8056.SchDoc: IN (in), OUT (out), NSHDN (in)
INV_neg5V = LTM8074neg.SchDoc: IN (in), OUT (out), RUN (in)
INV_neg5V_PA = LTM8074neg_PA.SchDoc: IN (in), OUT (out), RUN (in)
PA_LDO = LT3080.SchDoc: IN (in), OUT (out)

### Ports
FE_NSHDN_DEEP (in), TX_NSHDN (in)

### Nets
BUCKBOOST_OUT: R37.2 R38.2 ; sheet BUCK_5V5_PA/IN, sheet BUCK_5V5_PA/RUN, sheet PA_LDO/IN
EXTERNAL_PS: J5.A R21.1 R82.1
FE_3V3: C202.2 IC14.1(VCC) R115.2 R132.2
FE_3V8: C72.2 C192.2 R89.1 R98.2 R113.1
FE_5V0: R83.2
FE_5V5: C11.2 R33.2 R70.1 R95.1 ; sheet INV_neg5V/IN, sheet BUCK_5V5/OUT
FE_12V: R10.1 R38.1 R81.1  [project net FMC_12V_IN]
FE_-5V: C17.2 IC11.2(IN) ; sheet INV_neg5V/OUT
FE_PA_-5V: C20.2 C182.2 IC4.2(IN) IC12.2(IN) ; sheet INV_neg5V_PA/OUT
GND: C11.1 C17.1 C18.1 C68.1 C70.1 C72.1 C73.1 C192.1 C202.1 IC5.3(GND) IC5.6(GND) IC5.7(GND) IC10.3(GND) IC10.6(GND) IC10.7(GND) IC11.1(GND) IC14.4(GND) IC17.3(GND) IC17.6(GND) IC17.7(GND) R11.2 R19.2 R29.1 R30.1 R85.1 R87.1 R96.1 R133.2
LNA_3V3: R90.2
LNA_VG: R26.2
PA_5V: C203.2 IC18.1(VCC) R92.2
PA_GND: C20.1 C21.1 C75.1 C76.1 C182.1 C183.1 C203.1 IC4.1(GND) IC12.1(GND) IC18.4(GND) IC19.3(GND) IC19.6(GND) IC19.7(GND) J5.B J5.M1 J5.M2 R23.1 R24.1 R34.1 R35.1 R52.2 R97.1 R142.2
PA_VG3: R31.2
PA_VG12: R105.2
FE_NSHDN: R28.1 R50.1 ; port FE_NSHDN_DEEP
PA_PS_5V5: C75.2 R56.2 R80.2 R91.1 ; sheet INV_neg5V_PA/IN
PA_PS_IN: R81.2 R82.2 ; sheet BUCKBOOST_PA/IN
TX_NSHDN_ISO: IC18.2(RO) R57.1 R150.1
TX_NSHDND: IC14.3(DI) ; port TX_NSHDN  [project net TX_NSHDN]
TX_NSHDND_N: IC14.5(Y) IC18.8(A)
TX_NSHDND_P: IC14.6(Z) IC18.7(B)
NetC12_2: R37.1 ; sheet BUCKBOOST_PA/OUT
NetC15_1: C15.1 IC4.3(BYP)
NetC15_2: C15.2 C183.2 IC4.5(OUT) P1.1(CCW) R22.2 R105.1
NetC16_1: C16.1 IC11.3(BYP)
NetC16_2: C16.2 C18.2 IC11.5(OUT) P2.1(CCW) R26.1 R27.2
NetC19_1: C19.1 IC12.3(BYP)
NetC19_2: C19.2 C21.2 IC12.5(OUT) P3.1(CCW) R31.1 R32.2
NetC39_BUCK_3V8_2: R20.2 R95.2 ; sheet BUCK_3V8/IN
NetC39_BUCK_5V5_2: R10.2 R21.2 ; sheet BUCK_5V5/IN, sheet BUCK_5V5/RUN
NetC40_BUCK_3V8_2: R98.1 ; sheet BUCK_3V8/OUT
NetC68_2: C68.2 C69.2 IC5.1(OUT) R83.1 R84.2
NetC69_1: C69.1 IC5.4(BYP)
NetC70_2: C70.2 C71.2 IC10.1(OUT) R86.2 R115.1
NetC71_1: C71.1 IC10.4(BYP)
NetC73_2: C73.2 C74.2 IC17.1(OUT) R90.1 R93.2
NetC74_1: C74.1 IC17.4(BYP)
NetC76_2: C76.2 C77.2 IC19.1(OUT) R92.1 R94.2
NetC77_1: C77.1 IC19.4(BYP)
NetC91_2: R80.1 ; sheet BUCK_5V5_PA/OUT
NetIC2_L4: R150.2 ; sheet BUCKBOOST_PA/NSHDN
NetIC3_BUCK_3V8_A2: R20.1 R28.2 ; sheet BUCK_3V8/RUN
NetIC3_BUCK_3V8_D1: R19.1 ; sheet BUCK_3V8/FB
NetIC3_BUCK_5V5_D1: R11.1 ; sheet BUCK_5V5/FB
NetIC4_4: IC4.4(ADJ) P1.3(CW) R22.1 R24.2
NetIC5_2: IC5.2(ADJ) R84.1 R85.2
NetIC5_5: IC5.5(~{SHDN}) IC5.8(IN) R70.2
NetIC10_2: IC10.2(ADJ) R86.1 R87.2
NetIC10_5: IC10.5(~{SHDN}) IC10.8(IN) R113.2
NetIC11_4: IC11.4(ADJ) P2.3(CW) R27.1 R30.2
NetIC12_4: IC12.4(ADJ) P3.3(CW) R32.1 R35.2
NetIC13_A2: R33.1 R50.2 ; sheet INV_neg5V/RUN
NetIC14_7: IC14.7(B) R133.1
NetIC14_8: IC14.8(A) R132.1
NetIC17_2: IC17.2(ADJ) R93.1 R96.2
NetIC17_5: IC17.5(~{SHDN}) IC17.8(IN) R89.2
NetIC18_3: IC18.3(DI) R142.1
NetIC19_2: IC19.2(ADJ) R94.1 R97.2
NetIC19_5: IC19.5(~{SHDN}) IC19.8(IN) R91.2
NetIC24_D1: R52.1 ; sheet BUCK_5V5_PA/FB
NetIC25_A2: R56.1 R57.2 ; sheet INV_neg5V_PA/RUN
NetP1_2: P1.2(W) R23.2
NetP2_2: P2.2(W) R29.2
NetP3_2: P3.2(W) R34.2

Not connected (* = marked no-connect by the designer): IC14 2(RO)*; IC18 5(Y)* 6(Z)*

### Layout directives
net class midPower: FE_3V3, FE_3V8, FE_5V0, FE_5V5, FE_-5V, FE_PA_-5V, LNA_3V3, LNA_VG, NetC15_2, NetC16_2, NetC19_2, NetC68_2, NetC70_2, NetC73_2, NetC76_2, NetC91_2, NetIC5_5, NetIC10_5, NetIC17_5, NetIC19_5, PA_5V, PA_PS_5V5, PA_VG3, PA_VG12
net class highPower: BUCKBOOST_OUT, EXTERNAL_PS, FE_3V8, FE_5V5, NetC39_BUCK_5V5_2, PA_PS_IN

### Notes on the sheet
- (near R26) Starting from -4.5V
- (near R105) Starting from -4.5V
- (near R31) Starting from -4.5V
- (near R37) Now 20V.
- Project/Equipment
- Document
- Designer
- Drawn by
- Check.by
- File
- Last Mod.
- Print Date
- Sheet
- Size
- A3
- of
- Rev
- (in symbol LTC2851CMS8#PBF) R; D
- (in symbol R0402_10K_1%_0.0625W_100PPM) 1%
- (in symbol R0402_12K_1%_0.0625W_100PPM) 1%
- (in symbol R0402_22K_1%_0.0625W_100PPM) 1%
- (in symbol R0402_38K3_1%_0.0625W_100PPM) 1%
- (in symbol R0805_40K2_1%_0.125W_100PPM) 1%
- (in symbol R0805_62K_1%_0.125W_100PPM) 1%

### Library data of the parts
C11 C17 C20 C72 C75 C182 C192 = CC0603_1UF_25V_10%_X7R: Non-polarised capacitor; Part Description: SMD Multilayer Chip Ceramic Capacitor; Manufacturer: GENERIC; Manufacturer1 Part Number: GRM188R71E105KA12D; Voltage: 25V; TC: X7R; Tolerance: ±10%; Part Number: CC0603_1UF_25V_10%_X7R; Component Kind: Standard; Component Type: Standard; Pin Count: 2; Value: 1uF; Status: None; Manufacturer Part Number: CC0603_1UF_25V_10%_X7R; Case: 0603; Mounted: Yes; Socket: No; SMD: Yes; Sense: No; Manufacturer1 Example: MURATA; Manufacturer1 ComponentHeight: 0.9mm; HelpURL: \\cern.ch\dfs\Applications\Altium\Datasheets\CC0603_X7R_MURATA.pdf; Author: CERN DEM JLC; CreateDate: 18/01/2011; LatestRevisionDate: 18/01/2011
C15 C16 C19 = CC0603_10NF_50V_5%_C0G: Non-polarised capacitor; Part Description: SMD Multilayer Chip Ceramic Capacitor; Manufacturer: GENERIC; Manufacturer1 Part Number: C1608C0G1H103J080AA; Voltage: 50V; TC: C0G/NP0; Tolerance: ±5%; Part Number: CC0603_10NF_50V_5%_C0G; Component Kind: Standard; Component Type: Standard; Pin Count: 2; Value: 10nF; Status: Preferred; Manufacturer Part Number: CC0603_10NF_50V_5%_C0G; Case: 0603; Mounted: Yes; Socket: No; SMD: Yes; Sense: No; Manufacturer1 Example: TDK; Manufacturer1 ComponentHeight: 0.9mm; HelpURL: \\cern.ch\dfs\Applications\Altium\Datasheets\CC0603_C0G_TDK_C.pdf; Author: CERN DEM JLC; CreateDate: 10.12.2014; LatestRevisionDate: 10.12.2014
C18 C21 C68 C70 C73 C76 C183 = CC0805_10UF_25V_10%_X5R: Non-polarised capacitor; Part Description: SMD Multilayer Chip Ceramic Capacitor; Manufacturer: GENERIC; Manufacturer1 Part Number: GRM219R61E106KA12D; Voltage: 25V; TC: X5R; Tolerance: ±10%; Part Number: CC0805_10UF_25V_10%_X5R; Component Kind: Standard; Component Type: Standard; Pin Count: 2; Value: 10uF; Status: Preferred; Manufacturer Part Number: CC0805_10UF_25V_10%_X5R; Case: 0805; Mounted: Yes; Socket: No; SMD: Yes; Sense: No; Manufacturer1 Example: MURATA; Manufacturer1 ComponentHeight: 0.95mm; HelpURL: \\cern.ch\dfs\Applications\Altium\Datasheets\CC0805_X5R_MURATA_GRM.pdf; Author: CERN DEM JLC; CreateDate: 25/10/2012; LatestRevisionDate: 06/09/2016
C69 C71 C74 C77 = CC0402_10NF_50V_10%_X7R: Non-polarised capacitor; Part Description: SMD Multilayer Chip Ceramic Capacitor; Manufacturer: GENERIC; Manufacturer1 Part Number: GRM155R71H103KA88D; Voltage: 50V; TC: X7R; Tolerance: ±10%; Part Number: CC0402_10NF_50V_10%_X7R; Component Kind: Standard; Component Type: Standard; Pin Count: 2; Value: 10nF; Status: None; Manufacturer Part Number: CC0402_10NF_50V_10%_X7R; Case: 0402; Mounted: Yes; Socket: No; SMD: Yes; Sense: No; Manufacturer1 Example: MURATA; Manufacturer1 ComponentHeight: 0.55mm; HelpURL: \\cern.ch\dfs\Applications\Altium\Datasheets\CC0402_X7R_MURATA_GRM.pdf; Author: CERN DEM MR; CreateDate: 08.01.2016; LatestRevisionDate: 08.01.2016
C202 C203 = CC0402_100NF_16V_10%_X7R: Non-polarised capacitor; Part Description: SMD Multilayer Chip Ceramic Capacitor; Manufacturer: GENERIC; Manufacturer1 Part Number: GRM155R71C104KA88D; Voltage: 16V; TC: X7R; Tolerance: ±10%; Part Number: CC0402_100NF_16V_10%_X7R; Component Kind: Standard; Component Type: Standard; Pin Count: 2; Value: 100nF; Status: Not Recommended; Manufacturer Part Number: CC0402_100NF_16V_10%_X7R; Case: 0402; Mounted: Yes; Socket: No; SMD: Yes; Sense: No; Manufacturer1 Example: MURATA; Manufacturer1 ComponentHeight: 0.55mm; HelpURL: \\cern.ch\dfs\Applications\Altium\Datasheets\CC0402_X7R_MURATA_GRM.pdf; Author: CERN DEM JLC; CreateDate: 05.12.2013; LatestRevisionDate: 03.12.2007
IC4 IC11 IC12 = LT1964ES5-BYP#TRMPBF: 200mA, Low Noise, Low Dropout Negative Micropower Regulator; Part Description: -1.22V to -20V, 200mA, Low Noise, Low Dropout Negative Micropower Regulator; Manufacturer: LINEAR TECHNOLOGY; PressFit: No; Bonding: No; Part Number: LT1964ES5-BYP#TRMPBF; Component Kind: Standard; Component Type: Standard; Device: LT1964ES5-BYP#TRMPBF; PackageDescription: SOT23, 0.95mm pitch; 5 pin, 1.75mm W X 3.00mm L, IPC Medium Density; Manufacturer Part Number: LT1964ES5-BYP#TRMPBF; Pin Count: 5; Case: SOT23-5; Mounted: Yes; Socket: No; SMD: Yes; Sense: No; ComponentHeight: 1mm; HelpURL: \\cern.ch\dfs\Applications\Altium\Datasheets\LT1964ES5-BYP#TRMPBF.pdf; Author: CERN DEM MR; CreateDate: 17.02.2016; LatestRevisionDate: 17.02.2016
IC5 IC10 IC17 IC19 = LT1763CS8#PBF: 1.22V to 20V 500mA, Low Noise, LDO Adjustable Micropower Regulator; Manufacturer: LINEAR TECHNOLOGY; PressFit: No; Bonding: No; Part Number: LT1763CS8#PBF; Component Kind: Standard; Component Type: Standard; Device: LT1763CS8#PBF; PackageDescription: SOIC 8, Pitch 1.27mm, Body 4x5mm, IPC Medium Density; Part Description: 1.22V to 20V 500mA, Low Noise, LDO Adjustable Micropower Regulator; Manufacturer Part Number: LT1763CS8#PBF; Pin Count: 8; Case: SOIC8; Mounted: Yes; Socket: No; SMD: Yes; Sense: No; ComponentHeight: 1.75mm; HelpURL: \\cern.ch\dfs\Applications\Altium\Datasheets\LT1763CS8#PBF.pdf; Author: CERN DEM JLC; CreateDate: 11.01.2010; LatestRevisionDate: 11.01.2010
IC14 IC18 = LTC2851CMS8#PBF: 3.3V 20Mbps RS485/RS422 Transceivers; Manufacturer: LINEAR TECHNOLOGY; PressFit: No; Bonding: No; Part Number: LTC2851CMS8#PBF; Component Kind: Standard; Component Type: Standard; Device: LTC2851CMS8#PBF; PackageDescription: SOP, 0.65mm pitch; 8 pin, 3.00mm W X 3.00mm L X 1.10mm H body, IPC Medium Density; Part Description: 3.3V 20Mbps RS485/RS422 Transceivers; Manufacturer Part Number: LTC2851CMS8#PBF; Pin Count: 8; Case: MSOP8; Mounted: Yes; Socket: No; SMD: Yes; Sense: No; ComponentHeight: 1.1mm; HelpURL: \\cern.ch\dfs\Applications\Altium\Datasheets\LTC2851CMS8#PBF.pdf; Author: CERN DEM JLC; CreateDate: 14.12.2010; LatestRevisionDate: 14.12.2010
J5 = CON_M80-5000000M5-02-333-00-000: 2pin (2 power), THT socket with M2 jackscrews; Manufacturer: Harwin; Part Number: M80-5L10405M5-02-333-00-000; Bonding: No; ComponentHeigth: 6.05mm; PressFit: No; Case: M80-5000000M5-02-333-00-000; Component Kind: Standard; Component Type: Standard; CreateDate: 2018-06-18; Device: M80-5000000M5-02-333-00-000; HelpURL: https://www.harwin.com/products/M80-5000000M5-02-333-00-000/; LatestRevisionDate: 2018-06-18; Manufacturer Part Number: M80-5000000M5-02-333-00-000; Mounted: Yes; PackageDescription: H=6.05mm, W=18mm, D=8.6mm; Part Description: 2pin (2 power), THT socket with M2 jackscrews; Pin Count: 6; Sense: No; SMD: No; Socket: No; Value: *
P1-P3 = TRIM_11T_50K_BOURNS_3223W-1-503E: Trimming Potentiometer; Part Description: 11 Turns SMD Trimpot® Trimming Potentiometer (Top Adjust); Manufacturer: BOURNS; Power: 0.125W; TC: ±100ppm/°C; Tolerance: ±20%; PressFit: No; Part Number: TRIM_11T_50K_BOURNS_3223W-1-503E; Component Kind: Standard; Component Type: Standard; Pin Count: 3; Value: 50k; Manufacturer Part Number: 3223W-1-503E; Case: 3223W; Mounted: Yes; Socket: No; SMD: Yes; Sense: No; ComponentHeight: 4.16mm; HelpURL: \\cern.ch\dfs\Applications\Altium\Datasheets\TRIM_BOURNS_3223W.pdf; Author: CERN DEM JLC; CreateDate: 31.03.2011; LatestRevisionDate: 18.12.2012
R10 R38 R81 = R1206_NO-VALUE: Resistor; Part Description: Reserved Footprint For a 1206 (3216) Chip Resistor; PressFit: No; Mounted: No; Part Number: R1206_NO-VALUE; Component Kind: Standard; Component Type: Standard; Pin Count: 2; Value: Undefined; Status: None; Manufacturer: Undefined; Manufacturer Part Number: R1206_NO-VALUE; Case: 1206; Sense: No; Socket: No; SMD: Yes; Manufacturer1 Example: Undefined; Manufacturer1 Part Number: Undefined; Manufacturer1 ComponentHeight: 0.65mm; HelpURL: Undefined; Author: CERN DEM JLC; CreateDate: 03.12.2007; LatestRevisionDate: 13.03.2008
R11 R52 = R0805_40K2_1%_0.125W_100PPM: Resistor - 1%; Part Description: Thick Film Chip Resistor; Manufacturer: VISHAY; Manufacturer1 Part Number: CRCW080540K2FKEA; Power: 0.125W; TC: ±100ppm/°C; PressFit: No; Part Number: R0805_40K2_1%_0.125W_100PPM; Component Kind: Standard; Component Type: Standard; Pin Count: 2; Value: 40k2; Status: None; Tolerance: ±1%; Manufacturer Part Number: R0805_40K2_1%_0.125W_100PPM; Case: 0805; Mounted: Yes; Sense: No; Socket: No; SMD: Yes; Manufacturer1 Example: VISHAY; Manufacturer1 ComponentHeight: 0.6mm; HelpURL: \\cern.ch\dfs\Applications\Altium\Datasheets\R2512_VISHAY_CRCW0805.pdf; Author: CERN DEM JLC; CreateDate: 18.04.2013; LatestRevisionDate: 18.04.2013
R19 = R0805_62K_1%_0.125W_100PPM: Resistor - 1%; Part Description: General Purpose Thick Film Chip Resistor; Manufacturer: GENERIC; Manufacturer1 Part Number: NRC10F6202TRF; Power: 0.125W; TC: ±100ppm/°C; PressFit: No; Part Number: R0805_62K_1%_0.125W_100PPM; Component Kind: Standard; Component Type: Standard; Pin Count: 2; Value: 62k; Status: Preferred; Tolerance: ±1%; Manufacturer Part Number: R0805_62K_1%_0.125W_100PPM; Case: 0805; Mounted: Yes; Sense: No; Socket: No; SMD: Yes; Manufacturer1 Example: NIC COMPONENT; Manufacturer1 ComponentHeight: 0.6mm; HelpURL: \\cern.ch\dfs\Applications\Altium\Datasheets\R0805_NIC_NRC.pdf; Author: CERN DEM JLC; CreateDate: 03.12.2007; LatestRevisionDate: 13.03.2008
R20 R26 R31 R33 R56 R70 R83 R89-R92 R105 R113 R115 R132 R133 R142 = R0603_0R_JUMPER: Resistor; Part Description: 1A (0.05R Max DC Resistance) Zero Ohm Jumper; Manufacturer: GENERIC; Manufacturer1 Part Number: NRC06Z0; PressFit: No; Part Number: R0603_0R_JUMPER; Component Kind: Standard; Component Type: Standard; Pin Count: 2; Value: 0; Status: Preferred; Manufacturer Part Number: R0603_0R_JUMPER; Case: 0603; Mounted: Yes; Sense: No; Socket: No; SMD: Yes; Manufacturer1 Example: NIC COMPONENT; Manufacturer1 ComponentHeight: 0.55mm; HelpURL: \\cern.ch\dfs\Applications\Altium\Datasheets\R0603_NIC_NRC.pdf; Author: CERN DEM JLC; CreateDate: 03.12.2007; LatestRevisionDate: 13.03.2008
R21 R37 R80 R82 R95 R98 = R1206_0R_JUMPER: Resistor; Part Description: 2A (0.05R Max DC Resistance) Zero Ohm Jumper; Manufacturer: GENERIC; Manufacturer1 Part Number: NRC12Z0; PressFit: No; Part Number: R1206_0R_JUMPER; Component Kind: Standard; Component Type: Standard; Pin Count: 2; Value: 0; Status: Preferred; Manufacturer Part Number: R1206_0R_JUMPER; Case: 1206; Mounted: Yes; Sense: No; Socket: No; SMD: Yes; Manufacturer1 Example: NIC COMPONENT; Manufacturer1 ComponentHeight: 0.65mm; HelpURL: \\cern.ch\dfs\Applications\Altium\Datasheets\R1206_NIC_NRC.pdf; Author: CERN DEM JLC; CreateDate: 03.12.2007; LatestRevisionDate: 13.03.2008
R22 R24 R27 R28 R30 R32 R35 R50 R57 R150 = R0603_NO-VALUE: Resistor; Part Description: Reserved Footprint For a 0603 (1608) Chip Resistor; PressFit: No; Mounted: No; Part Number: R0603_NO-VALUE; Component Kind: Standard; Component Type: Standard; Pin Count: 2; Value: Undefined; Status: None; Manufacturer: Undefined; Manufacturer Part Number: R0603_NO-VALUE; Case: 0603; Sense: No; Socket: No; SMD: Yes; Manufacturer1 Example: Undefined; Manufacturer1 Part Number: Undefined; Manufacturer1 ComponentHeight: Undefined; HelpURL: Undefined; Author: CERN DEM JLC; CreateDate: 03.12.2007; LatestRevisionDate: 13.03.2008
R23 R29 R34 = R0402_10K_1%_0.0625W_100PPM: Resistor - 1%; Part Description: General Purpose Thick Film Chip Resistor; Manufacturer: GENERIC; Manufacturer1 Part Number: 232270671003L; TC: ±100ppm/°C; PressFit: No; Part Number: R0402_10K_1%_0.0625W_100PPM; Component Kind: Standard; Component Type: Standard; Pin Count: 2; Value: 10k; Status: Not Recommended; Power: 0.0625W; Tolerance: ±1%; Manufacturer Part Number: R0402_10K_1%_0.0625W_100PPM; Case: 0402; Mounted: Yes; Sense: No; Socket: No; SMD: Yes; Manufacturer1 Example: YAGEO PHYCOMP; Manufacturer1 ComponentHeight: 0.4mm; HelpURL: \\cern.ch\dfs\Applications\Altium\Datasheets\R0402_Phycomp_RC0402.pdf; Author: CERN DEM JLC; CreateDate: 03.12.2007; LatestRevisionDate: 17.10.2012
R84 R86 = R0402_22K_1%_0.0625W_100PPM: Resistor - 1%; Part Description: General Purpose Thick Film Chip Resistor; Manufacturer: GENERIC; Manufacturer1 Part Number: 232270672203L; TC: ±100ppm/°C; PressFit: No; Part Number: R0402_22K_1%_0.0625W_100PPM; Component Kind: Standard; Component Type: Standard; Pin Count: 2; Value: 22k; Status: Not Recommended; Power: 0.0625W; Tolerance: ±1%; Manufacturer Part Number: R0402_22K_1%_0.0625W_100PPM; Case: 0402; Mounted: Yes; Sense: No; Socket: No; SMD: Yes; Manufacturer1 Example: YAGEO PHYCOMP; Manufacturer1 ComponentHeight: 0.4mm; HelpURL: \\cern.ch\dfs\Applications\Altium\Datasheets\R0402_Phycomp_RC0402.pdf; Author: CERN DEM JLC; CreateDate: 03.12.2007; LatestRevisionDate: 17.10.2012
R85 R87 R96 R97 = R0402_12K_1%_0.0625W_100PPM: Resistor - 1%; Part Description: General Purpose Thick Film Chip Resistor; Manufacturer: GENERIC; Manufacturer1 Part Number: 232270671203L; TC: ±100ppm/°C; PressFit: No; Part Number: R0402_12K_1%_0.0625W_100PPM; Component Kind: Standard; Component Type: Standard; Pin Count: 2; Value: 12k; Status: Not Recommended; Power: 0.0625W; Tolerance: ±1%; Manufacturer Part Number: R0402_12K_1%_0.0625W_100PPM; Case: 0402; Mounted: Yes; Sense: No; Socket: No; SMD: Yes; Manufacturer1 Example: YAGEO PHYCOMP; Manufacturer1 ComponentHeight: 0.4mm; HelpURL: \\cern.ch\dfs\Applications\Altium\Datasheets\R0402_Phycomp_RC0402.pdf; Author: CERN DEM JLC; CreateDate: 03.12.2007; LatestRevisionDate: 17.10.2012
R93 R94 = R0402_38K3_1%_0.0625W_100PPM: Resistor - 1%; Part Description: General Purpose Thick Film Chip Resistor; Manufacturer: GENERIC; Manufacturer1 Part Number: 232270673833L or RC0402FR-0738K3L; TC: ±100ppm/°C; PressFit: No; Part Number: R0402_38K3_1%_0.0625W_100PPM; Component Kind: Standard; Component Type: Standard; Pin Count: 2; Value: 38k3; Status: Not Recommended; Power: 0.0625W; Tolerance: ±1%; Manufacturer Part Number: R0402_38K3_1%_0.0625W_100PPM; Case: 0402; Mounted: Yes; Sense: No; Socket: No; SMD: Yes; Manufacturer1 Example: YAGEO PHYCOMP; Manufacturer1 ComponentHeight: 0.4mm; HelpURL: \\cern.ch\dfs\Applications\Altium\Datasheets\R0402_Phycomp_RC0402.pdf; Author: CERN DEM BC; CreateDate: 29.07.2015; LatestRevisionDate: 29.07.2015